# Altium schematic sheet Linear Regulator.SchDoc: Linear Regulator
size A4
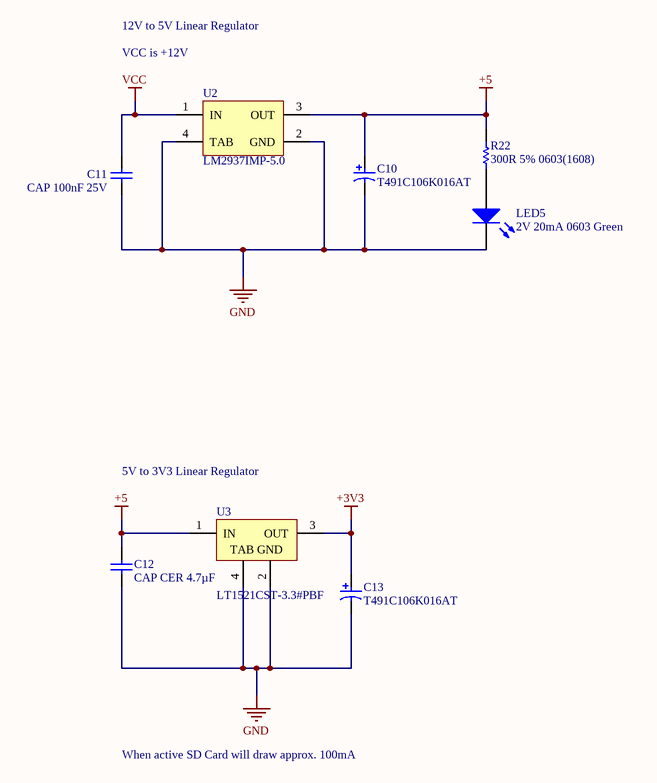
[diagram p0: Linear Regulator.SchDoc]

## Parts
C10  T491C106K016AT  [KEMT-T491-C_L]
C11  CAP 100nF 25V  [CAPC0603(1608)100_M]
C12  CAP CER 4.7µF  [CAPC1608X90X35NL10T15]
C13  T491C106K016AT  [KEMT-T491-C_L]
LED5  2V 20mA 0603 Green  [LITE-ON-LTST-C191KRKT-2_V]
R22  300R 5% 0603(1608)  [RESC0603(1608)_N]
U2  LM2937IMP-5.0  [DCY0004A_N]
U3  LT1521CST-3.3#PBF  [LT-ST-3-SOT-223_N]

## Nets
+3V3: C13.1 U3.3(OUT)
+5: C10.1 C12.2 R22.2 U2.3(OUT) U3.1(IN)
GND: C10.2 C11.1 C12.1 C13.2 LED5.2(K) U2.2(GND) U2.4(TAB) U3.2(GND) U3.4(TAB)
VCC: C11.2 U2.1(IN)
NetLED5_1: LED5.1(A) R22.1

## Notes on the sheet
- 12V to 5V Linear Regulator
- VCC is +12V
- 5V to 3V3 Linear Regulator
- When active SD Card will draw approx. 100mA
- Title
- Size:
- Date:
- A4
- Number:
- Time:
- Revision:
- Sheet
- of
- File:

## Library data of the parts
C10 C13 = CMP-2000-07197-1: Tantalum Capacitor, 10 uF, +/- 10%, 16 V, -55 to 125 degC, 2-Pin SMD (T491-C), RoHS, Tape and Reel; Manufacturer: Kemet; Product Diameter (mm): NotRequiredmm; Product Depth (mm): 3.2mm; ESR: 1.8ohm; Product Length (mm): 6mm; DCL: 1.6uA; Seal: NotRequired; Voltage: 16VDC; DF: 6%; Product Height (mm): 2.5mm; Polarity: Polar; Rad Hardened: No; Case Style: Molded; Capacitance: 10000000pF; Datasheet URL: http://capacitoredge.kemet.com/capedge2/DataSheet/Datasheet-T491C106K016AT.pdf?pn=T491C106K016AT; Datasheet Version: 10/2016; Packaging: TapeandReel; Tolerance (+ or -): 10%; Mounting Technology: SurfaceMount; Package Description: 2-Pin Surface Mount Device, Body 6 x 3.2 mm; Manufacturer URL: http://www.kemet.com/; Length W/Weld (max): NotRequiredmm; Lead Spacing (nom): NotRequiredmm; Operating Temp Range: -55Cto125C; Package Reference: T491-C; Mounting Style: SurfaceMount; Length W/Weld: NotRequiredmm; Failure Rate: NotRequired; Wire Form: NotRequired; Package / Case: 6032-28; Insulation: NotRequired; Construction: SMTChip; Seated Plane Height: NotRequiredmm; Case Code: C
C11 = CMP-1035-02588-1: CAP 100nF 25V ±10% 0603 (1608 Metric) Thickness 1mm SMD; Case-Metric: 1608; Case-EIA: 0603; Tolerance: Â±10%; Max Thickness: 1 mm; Technology: SMT; Rated Voltage: 25 V; Value: 100nF
C12 = CMP-2006-02523-1: GRM188R61E475KE11D; Manufacturer: Murata; Part Number: GRM188R61E475KE11D
LED5 = CMP-2000-05198-1: Chip LED, Green, 574 nm, 40 pF, -55 to 85 degC, 2-Pin SMD, RoHS, Tape and Reel; Manufacturer: Lite-On; Rad Hardened: No; Emitting Color: YellowGreen; Product Height (mm): 0.55mm; Forward Voltage: 2.4V; Number of Elements: 1; Dominant Wave Length: 571nm; DELETED: Compliant; Viewing Angle: 130deg; High Brightness: Yes; Peak Wavelength: 574nm; Type: Uni-Color; Forward Current: 30mA; Product Length (mm): 1.6mm; Luminous Intensity: 35mcd; Chip Material: AlGaInP; Product Depth (mm): 0.8mm; Shape Type: Rectangular; Reverse Voltage: 5V; Power Dissipation: 75W; Pin Count: 2; Lens Dimensions: 1.1X0.8X0.37mm; Packaging: TapeandReel; Main Category: ChipLED; Operating Temperature Classification: Industrial; Package Type: ChipLed; Test Current (It): 20mA; Mounting: SurfaceMount; Lum Intensity: 35mcd; Operating Temp Range: -55Cto85C; Datasheet Version: Jan-07; Datasheet URL: http://download.siliconexpert.com/pdfs/2007/08/26/semi_b/manual/lot/ds/ltst-c191kgkt.pdf; Manufacturer URL: http://www.us.liteon.com/
R22 = CMP-1012-00061-1: 300R 0.1W 5% 0603 (1608 Metric)  SMD; Case-EIA: 0603; Value: 300.00 Ohm; Case-Metric: 1608; Tolerance: 5 %; Power: 0.1 W; Technology: SMT
U2 = CMP-0062-01759-3: 500 mA Low Dropout Regulator, 4-pin SOT-223; Manufacturer: Texas Instruments; PowerWise: N; PackageTopMarking: XYTT*L71B; CompType: LDO IC; Code_JEDEC: TO-261-AA; PinCount: 4; ComponentLink1URL: http://www.ti.com/general/docs/lit/getliterature.tsp?genericPartNumber=LM2937&fileType=pdf; RoHS: N; Code_IPC: SOT223-4; ComponentLink1Description: Datasheet URL; PackageReference: DCY0004A; PackageDescription: Molded SOT-223, 6.50 x 3.56 x 1.6mm Body, 4 Lead, 2.3mm Pitch
U3 = CMP-0476-01842-1: 300 mA Low Dropout Regulator with Micropower Quiescent Current and Shutdown, 4.3 to 20 V Vin, 3.3 V Vout, 3-pin SOT223 (ST-3), 0 to 125 degC, Pb-Free; Manufacturer: Linear Technology; Shutdown Current(uA): 6; Vin Max(V): 20; Output Voltage: 3.3 V; Dropout Voltage(V): 0.5; Discrete Pass Element: no; Number of Outputs: 1; Isupply(mA): 0.012; Iout(mA): 300; Vin Min(V): 4.3; PartNumber: LT1521CST-3.3#PBF; ComponentLink1Description: Manufacturer URL; ComponentLink1URL: http://www.linear.com/; RoHS: TRUE; PackageReference: ST-3; PackageDescription: 3-Pin Plastic SOT-223, 3.505 x 6.505 mm Body, Pitch 2.3 mm; ComponentLink3Description: Package Specification; PackageVersion: Jun-10; Mounting Technology: Surface Mount; ComponentLink2Description: Datasheet; ComponentLink3URL: http://cds.linear.com/docs/en/packaging/SOT_3_05-08-1630.pdf; DatasheetVersion: Rev. B; ComponentLink2URL: http://cds.linear.com/docs/en/datasheet/1521335fb.pdf